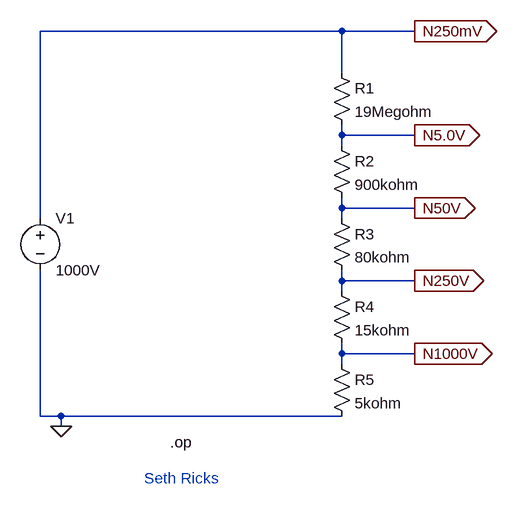
[diagram p0: schematic DMM_Lab.asc]
DMM_Lab.asc, the LTspice schematic file:
Version 4
SHEET 1 880 680
WIRE 160 -80 -304 -80
WIRE 272 -80 160 -80
WIRE 160 -16 160 -80
WIRE 160 80 160 64
WIRE 272 80 160 80
WIRE 160 96 160 80
WIRE 160 192 160 176
WIRE 272 192 160 192
WIRE -304 208 -304 -80
WIRE 160 208 160 192
WIRE 160 304 160 288
WIRE 272 304 160 304
WIRE 160 320 160 304
WIRE 160 416 160 400
WIRE 272 416 160 416
WIRE 160 432 160 416
WIRE -304 512 -304 288
WIRE -272 512 -304 512
WIRE 160 512 -272 512
WIRE -272 528 -272 512
FLAG -272 528 0
FLAG 272 -80 N250mV
IOPIN 272 -80 Out
FLAG 272 80 N5.0V
IOPIN 272 80 Out
FLAG 272 192 N50V
IOPIN 272 192 Out
FLAG 272 304 N250V
IOPIN 272 304 Out
FLAG 272 416 N1000V
IOPIN 272 416 Out
SYMBOL res 144 -32 R0
SYMATTR InstName R1
SYMATTR Value 19Megohm
SYMBOL res 144 80 R0
SYMATTR InstName R2
SYMATTR Value 900kohm
SYMBOL res 144 192 R0
SYMATTR InstName R3
SYMATTR Value 80kohm
SYMBOL res 144 304 R0
SYMATTR InstName R4
SYMATTR Value 15kohm
SYMBOL res 144 416 R0
SYMATTR InstName R5
SYMATTR Value 5kohm
SYMBOL voltage -304 192 R0
WINDOW 123 0 0 Left 0
WINDOW 39 0 0 Left 0
SYMATTR InstName V1
SYMATTR Value 1000V
TEXT -104 552 Left 2 !.op
TEXT -144 608 Left 2 ;Seth Ricks

The netlist it stands for:
* DMM_Lab.asc
R1 N250mV N5.0V 19Megohm
R2 N5.0V N50V 900kohm
R3 N50V N250V 80kohm
R4 N250V N1000V 15kohm
R5 N1000V 0 5kohm
V1 N250mV 0 1000V
.op
* Seth Ricks
.backanno
.end

* Results of the author's LTspice run, read from the files saved beside the schematic
* Operating Point:
*   V(n250mv) = 1 kV
*   V(n5.0v) = 50 V
*   V(n50v) = 5 V
*   V(n250v) = 1 V
*   V(n1000v) = 250 mV
*   I(R5) = 50 µA
*   I(R4) = 50 µA
*   I(R3) = 50 µA
*   I(R2) = 50 µA
*   I(R1) = 50 µA
*   I(V1) = -50 µA